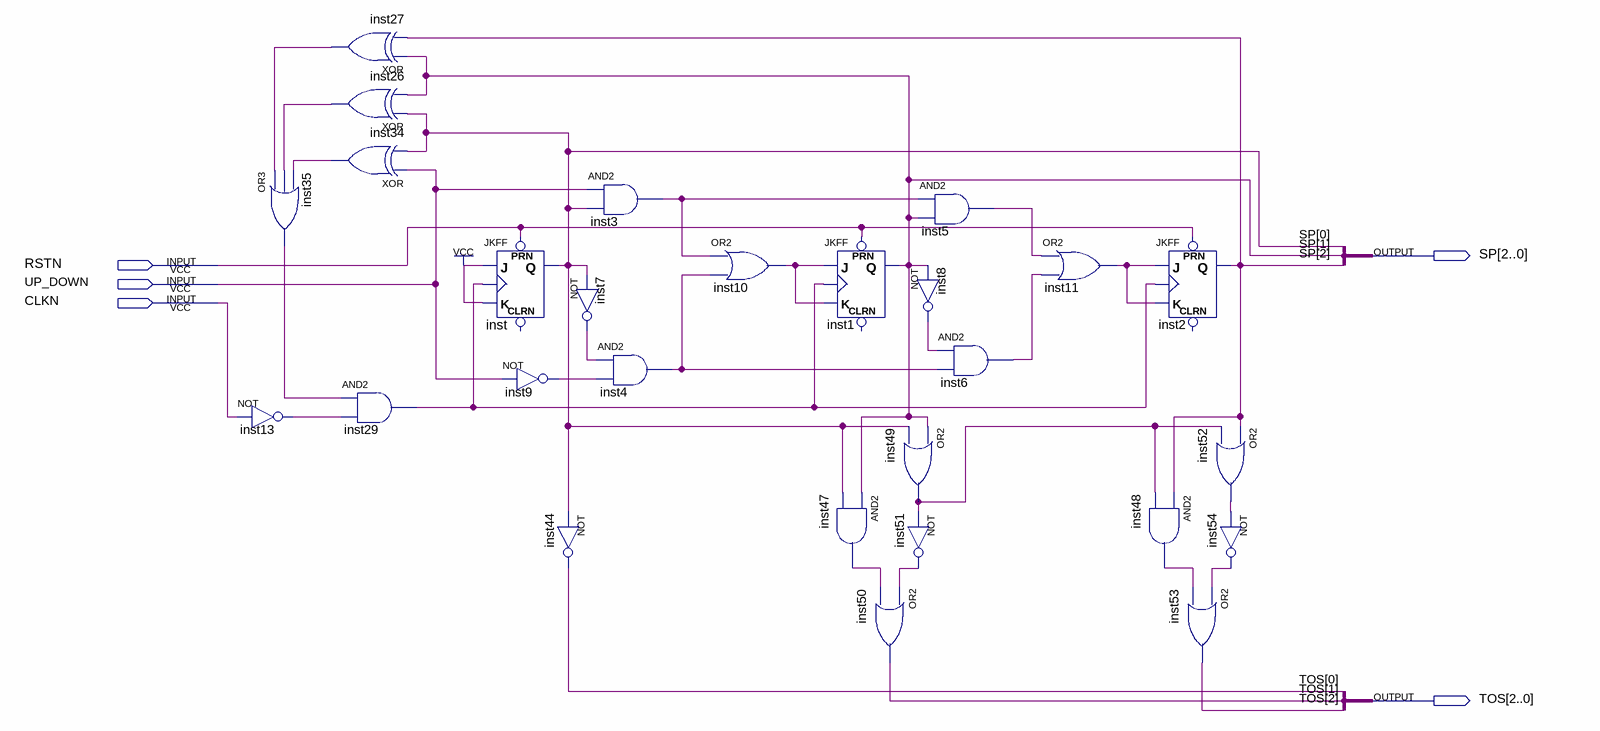
[diagram p0: schematic sheet]
// Quartus schematic CONT_3b.bdf as structural Verilog: 27 symbols, 5 pins
module CONT_3b (
  input  RSTN,
  input  UP_DOWN,
  input  CLKN,
  output [2:0] SP,
  output [2:0] TOS
);

  wire inst3_out, inst4_out, inst5_out, inst6_out, inst7_out, inst8_out, inst9_out, inst10_out, inst11_out,
       inst13_out, inst26_out, inst27_out, inst29_out, inst34_out, inst35_out, inst47_out, inst48_out,
       inst49_out, inst51_out, inst52_out, inst54_out;

  or inst35 (inst35_out, inst27_out, inst26_out, inst34_out);
  not inst13 (inst13_out, CLKN);
  xor inst27 (inst27_out, SP[1], SP[2]);
  xor inst26 (inst26_out, SP[0], SP[1]);
  xor inst34 (inst34_out, UP_DOWN, SP[0]);
  and inst29 (inst29_out, inst35_out, inst13_out);
  JKFF inst (.PRN(RSTN), .K(1'b1), .J(1'b1), .CLK(inst29_out), .Q(SP[0]));  // open: CLRN
  not inst7 (inst7_out, SP[0]);
  not inst9 (inst9_out, UP_DOWN);
  not inst44 (TOS[0], SP[0]);
  and inst3 (inst3_out, UP_DOWN, SP[0]);
  and inst4 (inst4_out, inst7_out, inst9_out);
  or inst10 (inst10_out, inst3_out, inst4_out);
  JKFF inst1 (.PRN(RSTN), .K(inst10_out), .J(inst10_out), .CLK(inst29_out), .Q(SP[1]));  // open: CLRN
  and inst47 (inst47_out, SP[1], SP[0]);
  or inst50 (TOS[1], inst51_out, inst47_out);
  and inst5 (inst5_out, inst3_out, SP[1]);
  not inst8 (inst8_out, SP[1]);
  and inst6 (inst6_out, inst8_out, inst4_out);
  or inst49 (inst49_out, SP[1], SP[0]);
  not inst51 (inst51_out, inst49_out);
  or inst11 (inst11_out, inst5_out, inst6_out);
  JKFF inst2 (.PRN(RSTN), .K(inst11_out), .J(inst11_out), .CLK(inst29_out), .Q(SP[2]));  // open: CLRN
  and inst48 (inst48_out, SP[2], inst49_out);
  or inst53 (TOS[2], inst54_out, inst48_out);
  or inst52 (inst52_out, SP[2], inst49_out);
  not inst54 (inst54_out, inst52_out);
endmodule
